# EasyEDA Pro project PCBA_碳化硅3KW图腾柱PFC_2025-04-21.epro, board PCB1_1
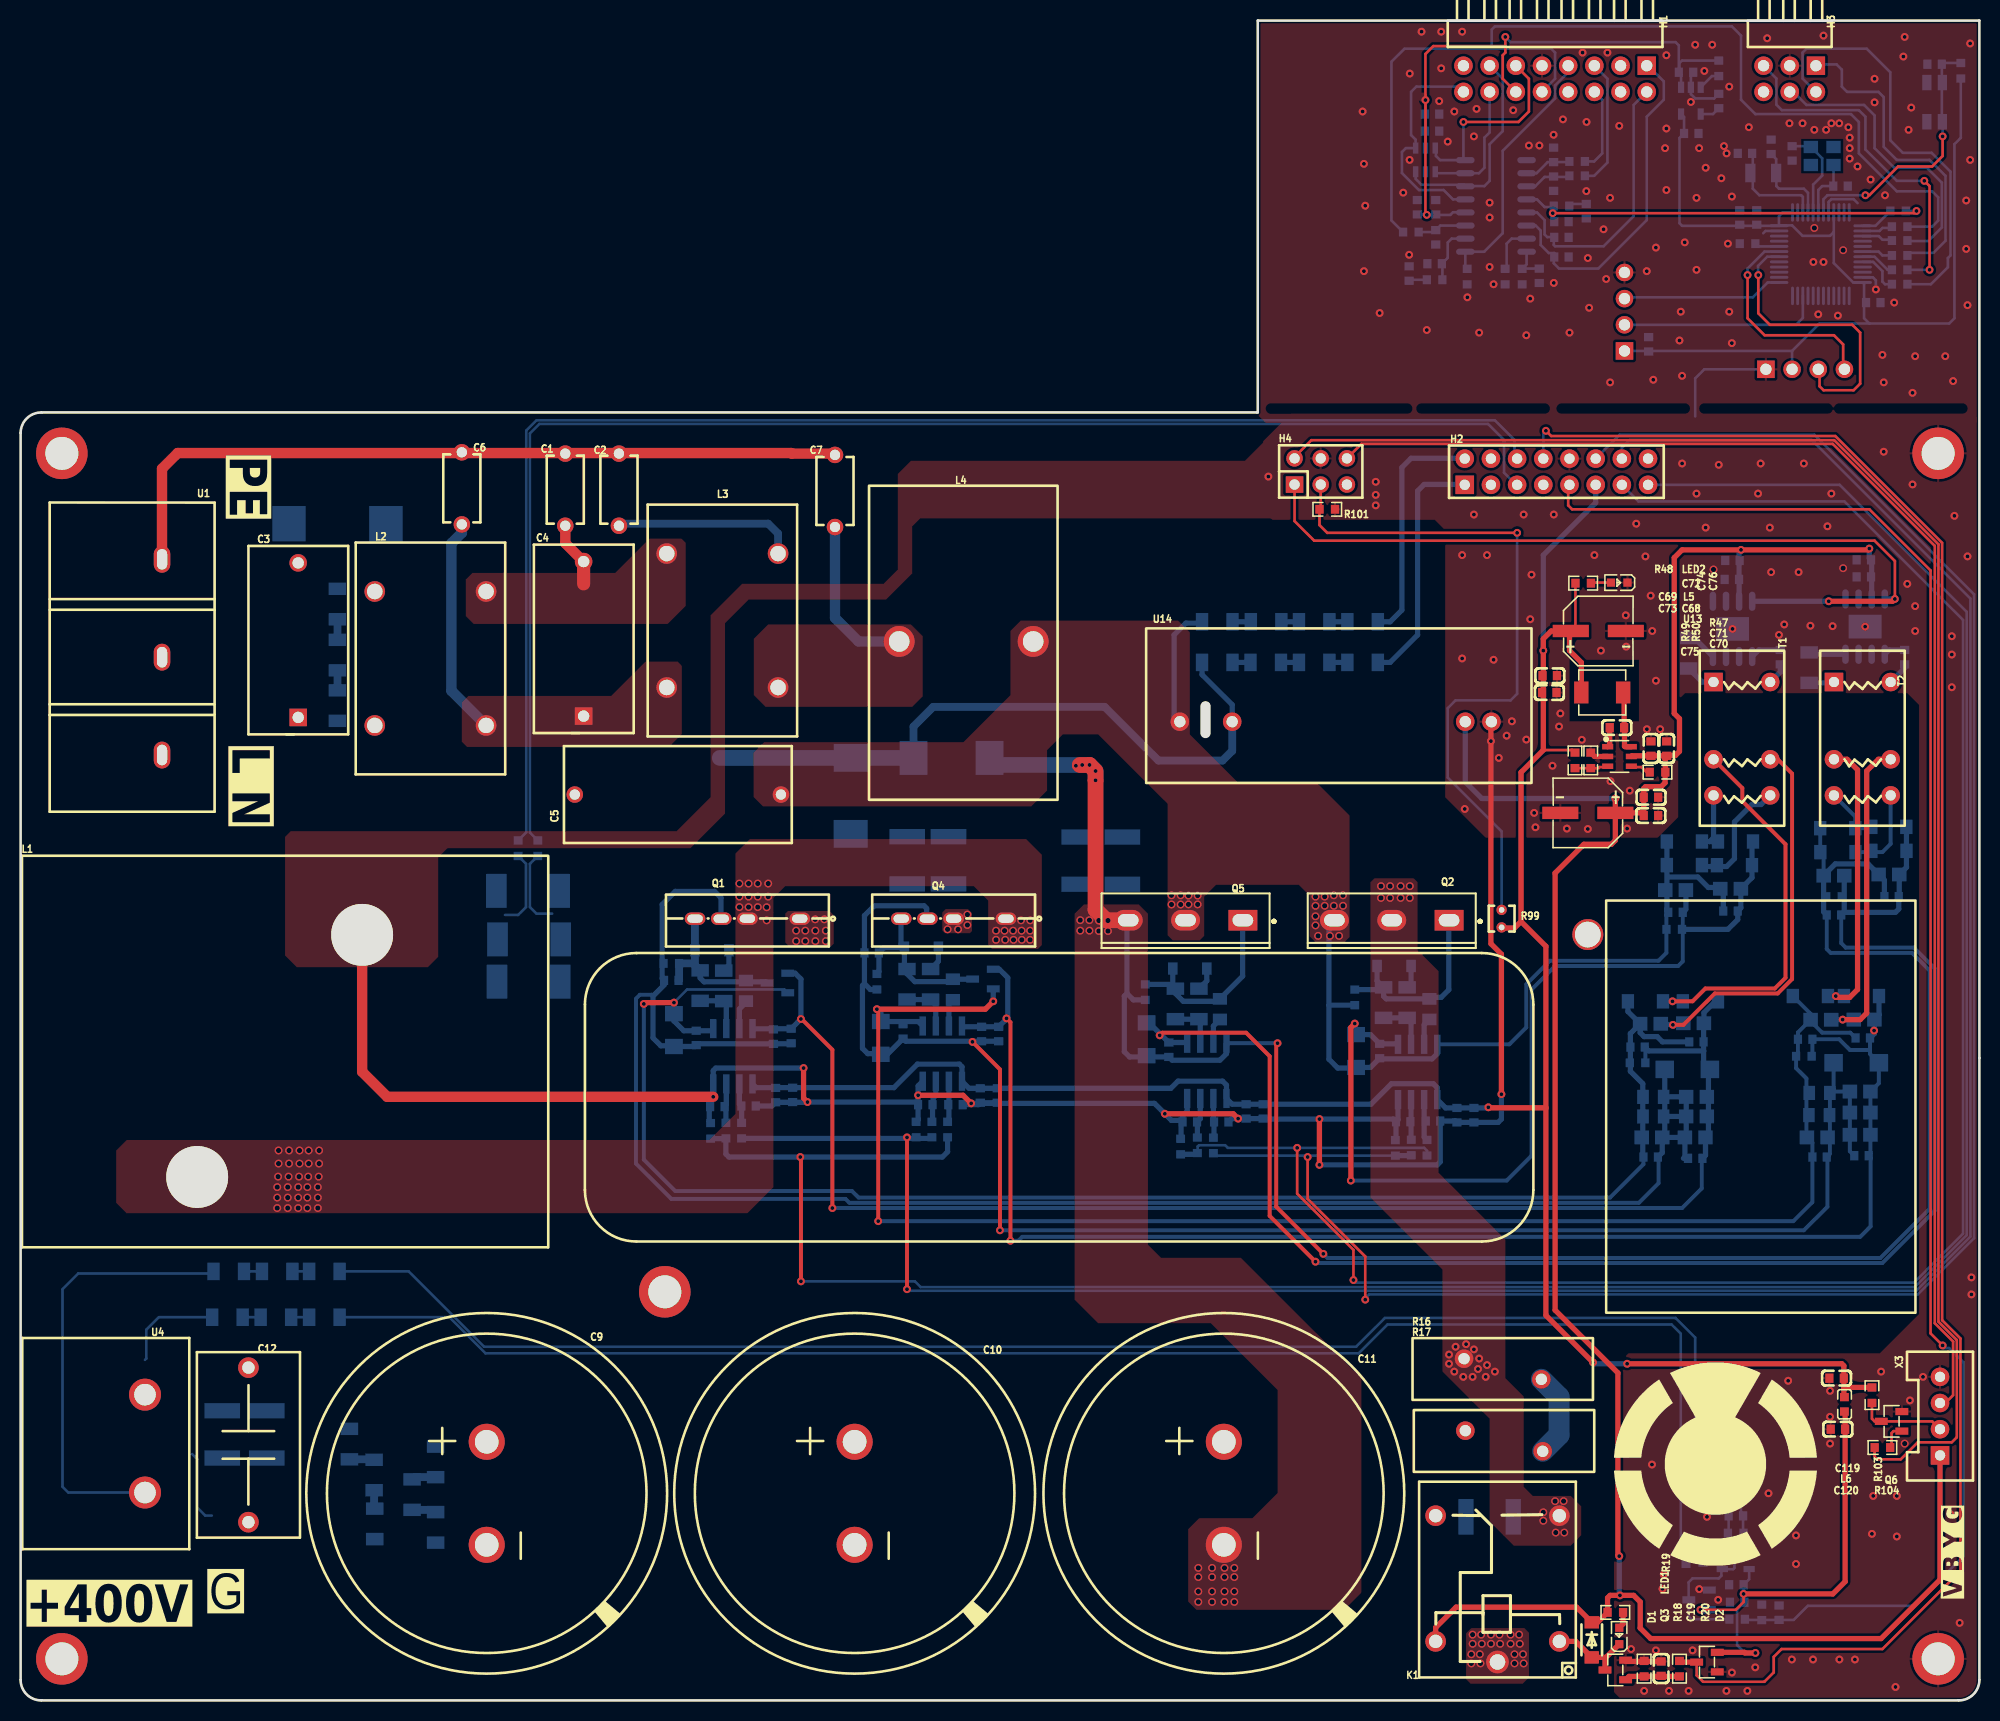
[diagram p6: board, top side]
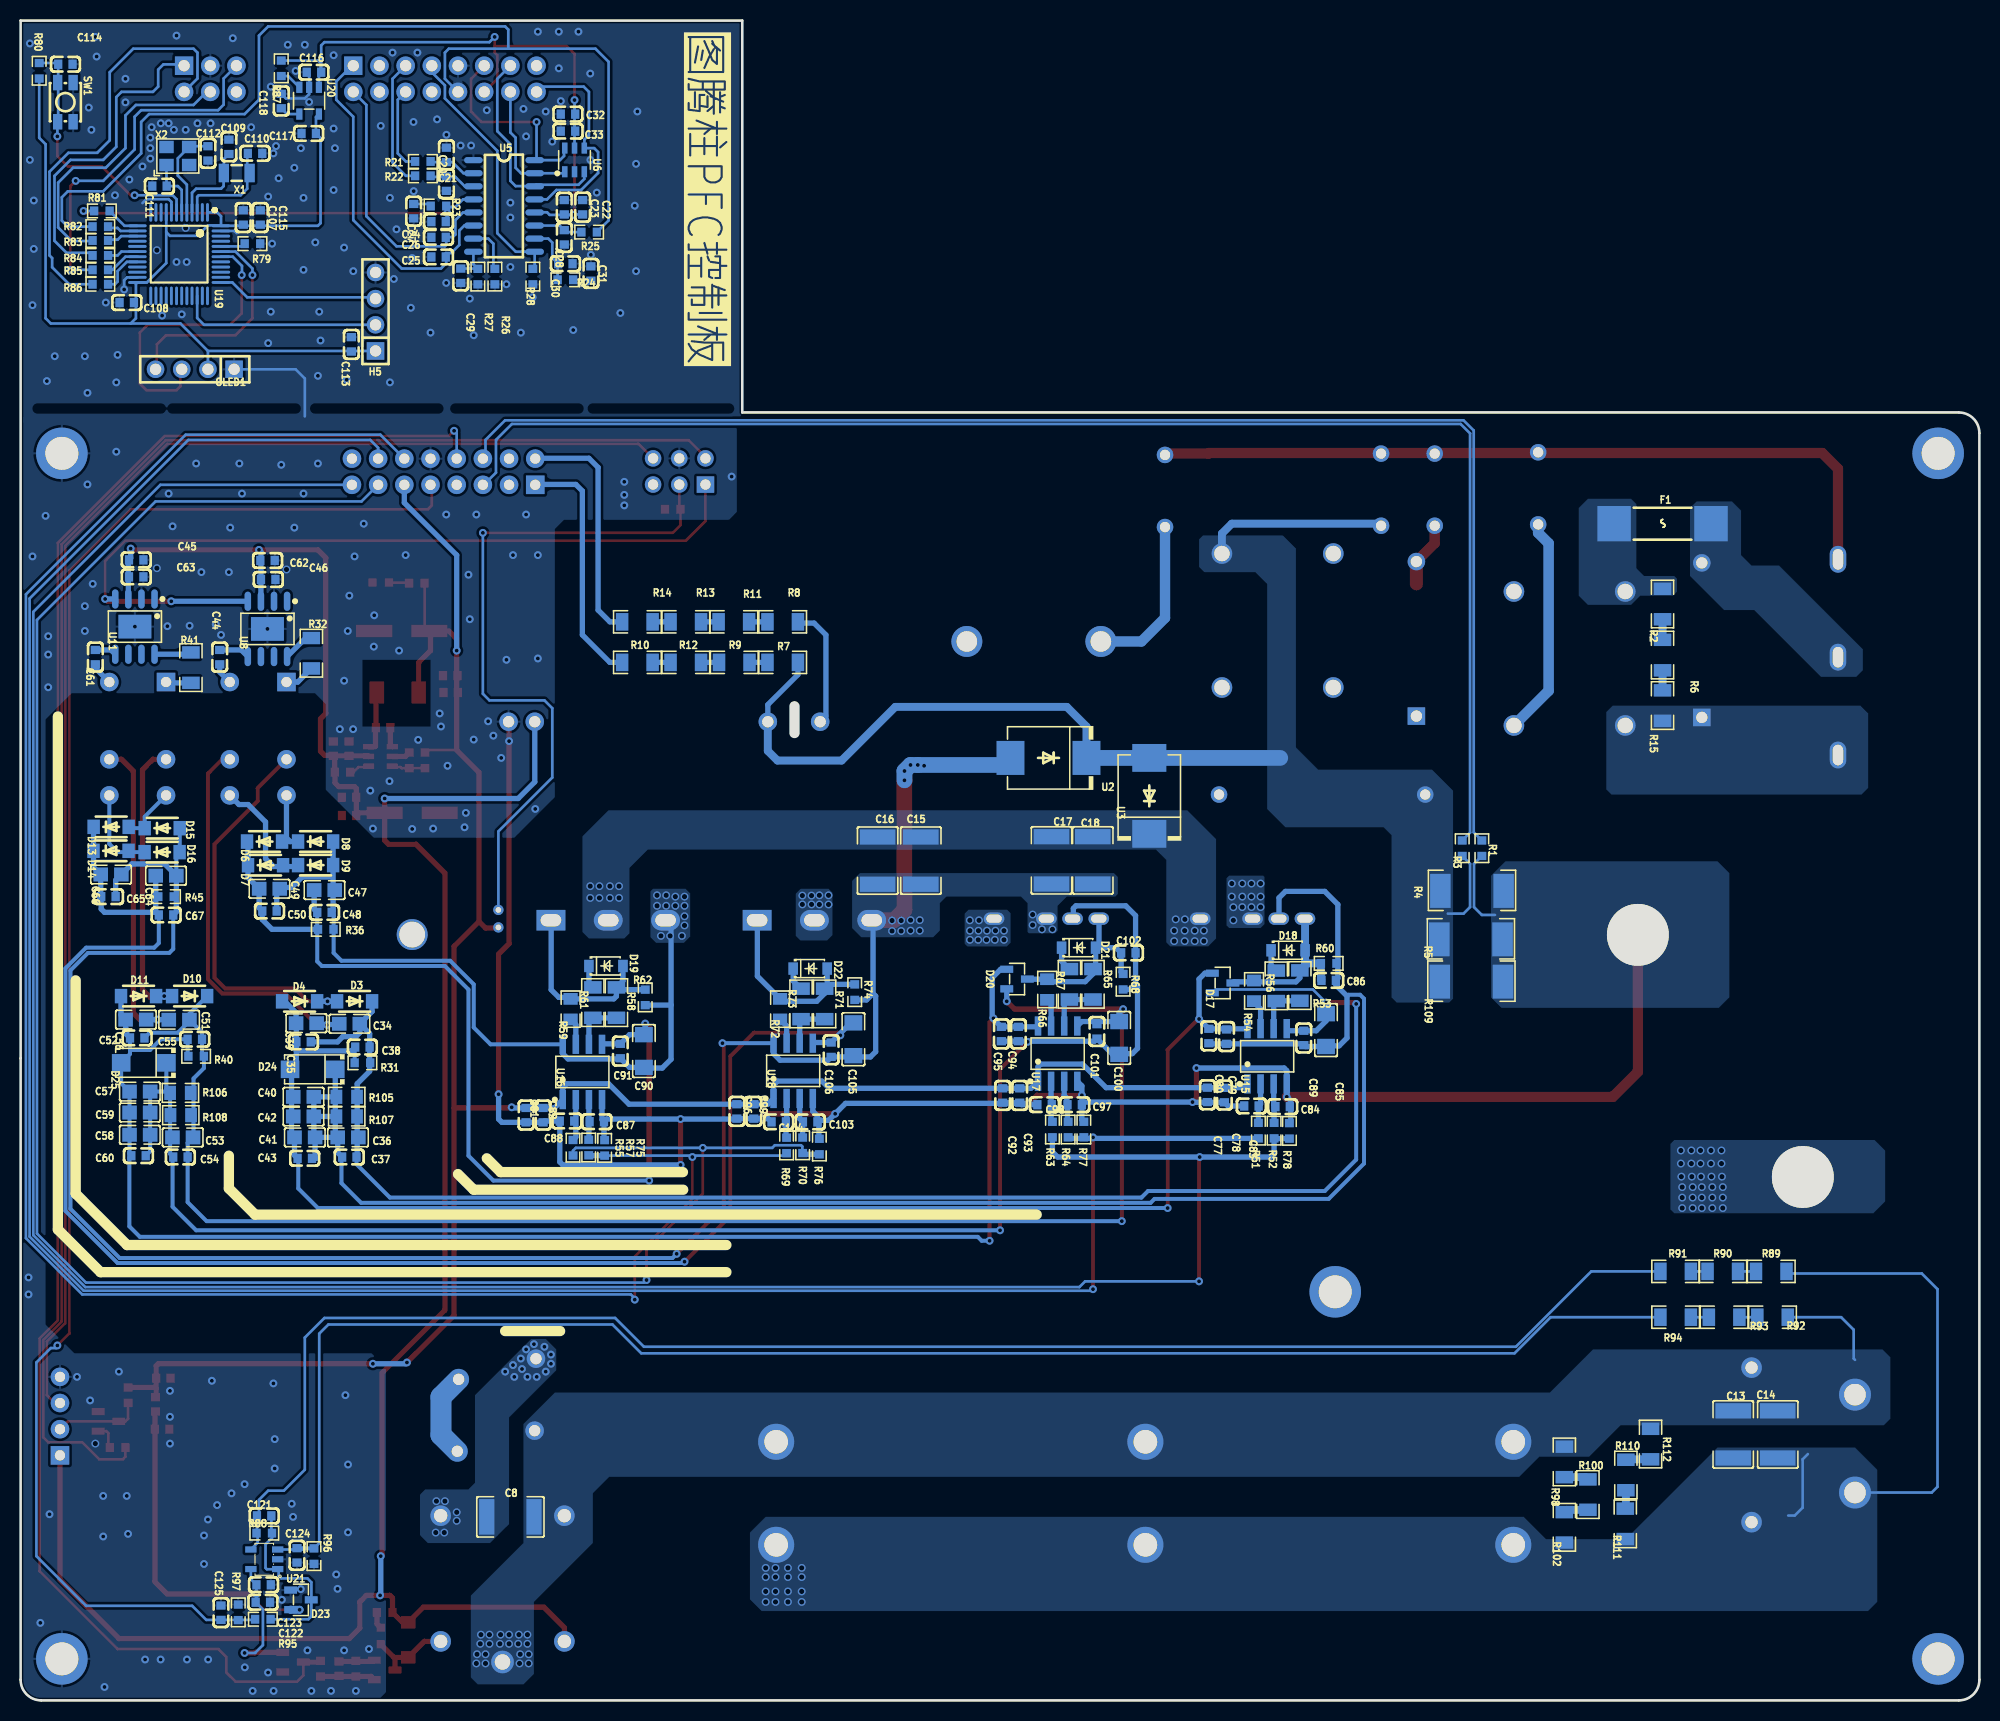
[diagram p7: board, bottom side, seen from below]

Outline 190 x 163.03 mm; copper layers: Top Layer, Bottom Layer. Coordinates in mm from the lower left corner of the outline.
Outline path: 0,123 0,2 arc(0.59,0.59) 2,0 188,0 arc(189.41,0.59) 190,2 190,163.03 120,163.03 120,125 2,125 arc(0.59,124.41) 0,123
Stack: Top Layer 0.035mm / Dielectric1 1.51mm FR4 er 4.5 / Bottom Layer 0.035mm

## Design rules (mm)
template: JLCPCB Capability(Two Layers Board)
spacing copperThickness1oz (default): track to track 0.102, other pairs 0.152 to 0.3
spacing copperThickness2oz: track to track 0.203, other pairs 0.152 to 0.3
track width copperThickness1oz (default): min 0.127, default 0.254, max 2.54
track width copperThickness2oz: min 0.203, default 0.254, max 2.54
differential pair differentialPair (default): width min 0.127, default 0.254, max 2.54; gap min 0.152, default 0.152
via viaSize (default): diameter min 0.5, default 0.61, max 10; hole min 0.3, default 0.305, max 6.3

## Placement (name value [footprint] x y rotation side)
C1  2.2nF  [CAP-TH_L6.5-W3.5-P7.50-D1.0]  52.83 117.51 90 top
C2  2.2nF  [CAP-TH_L6.5-W3.5-P7.50-D1.0]  58.04 117.51 90 top
C3  1uF  [CONN-TH_L18.0-W9.5_MPX105K31D5KN15800]  26.92 102.9 90 top
C4  1uF  [CONN-TH_L18.0-W9.5_MPX105K31D5KN15800]  54.61 103.03 90 top
C5  2.2uF  [CAP-TH_L22.0-W9.5-P20.00-D0.7]  63.75 87.92 180 top
C6  2.2nF  [CAP-TH_L6.5-W3.5-P7.50-D1.0]  42.8 117.63 270 top
C7  2.2nF  [CAP-TH_L6.5-W3.5-P7.50-D1.0]  78.99 117.38 90 top
C8  100nF  [C1812]  142.49 17.81 0 bottom
C9  470uF  [CAP-TH_BD35.0-P10.00-D2.3-FD]  45.21 20.1 270 top
C10  470uF  [CAP-TH_BD35.0-P10.00-D2.3-FD]  80.9 20.1 270 top
C11  470uF  [CAP-TH_BD35.0-P10.00-D2.3-FD]  116.71 20.1 270 top
C12  100nF  [CAP-TH_L18.0-W10.0-P15.00-D0.8]  22.1 24.8 90 top
C13  100nF  [C1812]  23.88 25.81 90 bottom
C14  100nF  [C1812]  19.56 25.81 90 bottom
C15  100nF  [C1812]  102.68 81.5 270 bottom
C16  100nF  [C1812]  106.87 81.5 270 bottom
C17  100nF  [C1812]  90 81.53 90 bottom
C18  100nF  [C1812]  86 81.53 90 bottom
C19  1nF  [C0603]  159.13 3.08 270 top
C20  1nF  [C0603]  148.7 150 90 bottom
C21  1nF  [C0603]  148.7 147.2 270 bottom
C22  1uF  [C0603]  135.49 144.92 270 bottom
C23  100nF  [C0603]  137.27 144.92 90 bottom
C24  22pF  [C0603]  149.46 143.52 180 bottom
C25  22pF  [C0603]  149.46 140.09 180 bottom
C26  22pF  [C0603]  149.46 142 180 bottom
C27  4.7nF  [C0603]  151.87 144.54 90 bottom
C28  1nF  [C0603]  137.27 142 90 bottom
C29  3.3uF  [C0603]  147.31 138.27 90 bottom
C30  22nF  [C0603]  137.16 139.44 0 bottom
C31  470nF  [C0603]  134.69 138.49 270 bottom
C32  1uF  [C0603]  136.91 153.96 180 bottom
C33  100nF  [C0603]  136.91 152.31 0 bottom
C34  4.7uF  [C0805]  158.1 65.67 180 bottom
C35  100nF  [C0603]  162.55 63.91 180 bottom
C36  10uF  [C0805]  158.24 54.64 180 bottom
C37  100nF  [C0603]  158.12 52.74 180 bottom
C38  10nF  [C0603]  156.84 63.41 180 bottom
C39  4.7uF  [C0805]  162.28 65.72 180 bottom
C40  10uF  [C0805]  162.56 58.58 180 bottom
C41  10uF  [C0805]  162.43 54.64 180 bottom
C42  10uF  [C0805]  162.56 56.67 180 bottom
C43  100nF  [C0603]  162.44 52.61 180 bottom
C44  1uF  [C0603]  170.69 101.25 270 bottom
C45  1uF  [C0603]  178.79 110.69 0 bottom
C46  100nF  [C0603]  165.99 108.79 0 bottom
C47  4.7uF  [C0805]  160.53 78.65 0 bottom
C48  100nF  [C0603]  160.53 76.49 0 bottom
C49  10uF  [C0805]  165.86 78.77 0 bottom
C50  10nF  [C0603]  165.86 76.61 0 bottom
C51  4.7uF  [C0805]  174.63 66.06 180 bottom
C52  100nF  [C0603]  178.69 64.29 180 bottom
C53  10uF  [C0805]  174.28 54.64 180 bottom
C54  100nF  [C0603]  174.5 52.74 180 bottom
C55  10nF  [C0603]  173.1 64.17 180 bottom
C56  4.7uF  [C0805]  178.82 66.07 180 bottom
C57  10uF  [C0805]  178.44 59.09 180 bottom
C58  10uF  [C0805]  178.44 54.9 180 bottom
C59  10uF  [C0805]  178.44 57.06 180 bottom
C60  100nF  [C0603]  178.56 52.86 180 bottom
C61  1uF  [C0603]  182.75 101.25 270 bottom
C62  1uF  [C0603]  166.05 110.64 0 bottom
C63  100nF  [C0603]  178.79 109.04 0 bottom
C64  4.7uF  [C0805]  175.9 80.04 0 bottom
C65  100nF  [C0603]  181.48 78.01 0 bottom
C66  10uF  [C0805]  181.23 80.16 0 bottom
C67  10nF  [C0603]  175.9 76.23 0 bottom
C68  100nF  [C0603]  154.84 94.41 0 top
C69  100nF  [C0603]  148.33 99.46 180 top
C70  1uF  [C0603]  158.14 85.88 0 top
C71  100nF  [C0603]  158.14 87.66 180 top
C72  100uF  [CAP-SMD_BD6.3-L6.6-W6.6-FD]  153.03 103.79 0 top
C73  1uF  [C0603]  148.28 97.82 180 top
C74  100nF  [C0603]  158.14 92.38 270 top
C75  47uF  [CAP-SMD_BD6.3-L6.6-W6.6-LS7.2-FD]  152.02 86.14 180 top
C76  1uF  [C0603]  159.67 92.38 270 top
C77  1uF  [C0603]  74.89 58.77 270 bottom
C78  100nF  [C0603]  73.23 58.75 270 bottom
C79  100nF  [C0603]  73.03 64.42 270 bottom
C80  10uF  [C0603]  74.74 64.48 270 bottom
C81  1uF  [C0603]  140.97 56.8 270 bottom
C82  100nF  [C0603]  139.32 56.8 270 bottom
C83  220pF  [C0603]  70.61 57.69 180 bottom
C84  220pF  [C0603]  67.59 57.63 0 bottom
C85  10uF  [C1206]  63.37 65.06 90 bottom
C86  1nF  [C0603]  63.12 69.88 0 bottom
C87  220pF  [C0603]  134.11 56.17 0 bottom
C88  220pF  [C0603]  137 56.23 180 bottom
C89  100nF  [C0603]  65.53 64.29 90 bottom
C90  10uF  [C1206]  129.54 63.02 90 bottom
C91  100nF  [C0603]  131.83 63.02 90 bottom
C92  1uF  [C0603]  94.74 58.71 270 bottom
C93  100nF  [C0603]  93.09 58.71 270 bottom
C94  100nF  [C0603]  93.22 64.68 270 bottom
C95  10uF  [C0603]  94.87 64.68 270 bottom
C96  1uF  [C0603]  120.53 57.16 270 bottom
C97  220pF  [C0603]  87.76 57.82 0 bottom
C98  220pF  [C0603]  90.68 57.82 180 bottom
C99  100nF  [C0603]  118.87 57.16 270 bottom
C100  10uF  [C1206]  83.44 64.29 90 bottom
C101  100nF  [C0603]  85.6 64.93 90 bottom
C102  1nF  [C0603]  82.55 72.55 0 bottom
C103  220pF  [C0603]  113.41 56.15 0 bottom
C104  220pF  [C0603]  116.46 56.15 180 bottom
C105  10uF  [C1206]  109.22 64.17 90 bottom
C106  100nF  [C0603]  111.38 63.15 90 bottom
C107  100nF  [C0603]  166.75 143.92 90 bottom
C108  100nF  [C0603]  179.71 135.67 0 bottom
C109  10pF  [C0603]  169.8 150.78 270 bottom
C110  10pF  [C0603]  167.26 150.15 180 bottom
C111  10pF  [C0603]  176.53 146.97 180 bottom
C112  10pF  [C0603]  171.83 150.15 270 bottom
C113  100nF  [C0603]  157.92 131.61 90 bottom
C114  100nF  [C0603]  185.66 158.8 0 bottom
C115  100nF  [C0603]  168.4 143.92 90 bottom
C116  1uF  [C0603]  161.54 158.02 180 bottom
C117  1uF  [C0603]  162.05 152.08 180 bottom
C118  22nF  [C0603]  164.72 155.23 270 bottom
C119  10uF  [C0603]  176.15 31.27 0 top
C120  10uF  [C0603]  176.28 26.32 0 top
C121  1nF  [C0603]  166.38 17.91 0 bottom
C122  1uF  [C0603]  166.5 9.53 0 bottom
C123  100nF  [C0603]  166.43 11.22 180 bottom
C124  1nF  [C0603]  163.19 14.08 270 bottom
C125  1nF  [C0603]  170.57 8.51 270 bottom
D1  DSK110  [SOD-123_L2.8-W1.8-LS3.7-FD]  152.4 5.87 90 top
D2  BAV99  [SOT-23-3_L2.9-W1.3-P1.90-LS2.4-BR]  163.58 3.72 0 top
D3  DSK110  [SOD-123_L2.8-W1.8-LS3.7-FD]  157.61 67.85 180 bottom
D4  null  [SOD-123_L2.8-W1.8-LS3.7-FD]  162.94 67.85 180 bottom
D6  DSK110  [SOD-123_L2.8-W1.8-LS3.7-FD]  166.34 83.36 0 bottom
D7  DSK110  [SOD-123_L2.8-W1.8-LS3.7-FD]  166.24 81.06 0 bottom
D8  null  [SOD-123_L2.8-W1.8-LS3.7-FD]  161.39 83.36 0 bottom
D9  DSK110  [SOD-123_L2.8-W1.8-LS3.7-FD]  161.39 81.07 0 bottom
D10  DSK110  [SOD-123_L2.8-W1.8-LS3.7-FD]  173.61 68.36 180 bottom
D11  null  [SOD-123_L2.8-W1.8-LS3.7-FD]  178.56 68.36 180 bottom
D13  DSK110  [SOD-123_L2.8-W1.8-LS3.7-FD]  181.22 84.78 0 bottom
D14  DSK110  [SOD-123_L2.8-W1.8-LS3.7-FD]  181.23 82.46 0 bottom
D15  null  [SOD-123_L2.8-W1.8-LS3.7-FD]  176.26 84.65 0 bottom
D16  DSK110  [SOD-123_L2.8-W1.8-LS3.7-FD]  176.28 82.33 0 bottom
D17  BAV99  [SOT-23-3_L2.9-W1.3-P1.90-LS2.4-BR]  73.41 69.63 0 bottom
D18  SODSF14-SH  [SOD-123FL_L2.8-W1.8-LS3.7-RD-1]  67.06 72.8 180 bottom
D19  SODSF14-SH  [SOD-123FL_L2.8-W1.8-LS3.7-RD-1]  133.22 71.28 180 bottom
D20  BAV99  [SOT-23-3_L2.9-W1.3-P1.90-LS2.4-BR]  93.34 70.01 0 bottom
D21  SODSF14-SH  [SOD-123FL_L2.8-W1.8-LS3.7-RD-1]  87.38 73.06 180 bottom
D22  SODSF14-SH  [SOD-123FL_L2.8-W1.8-LS3.7-RD-1]  113.41 71.03 180 bottom
D23  BAV99  [SOT-23-3_L2.9-W1.3-P1.90-LS2.4-BR]  162.81 9.76 0 bottom
D24  null  [SMA_L4.4-W2.6-LS5.0-RD]  161.67 61.25 0 bottom
D25  null  [SMA_L4.4-W2.6-LS5.0-RD]  178.05 61.88 0 bottom
F1  0463020.ER  [FUSE-SMD_L10.1-W3.1]  30.73 114.21 0 bottom
H1  PZ254R-12-16P  [HDR-TH_16P-P2.54-H-M-R2-C8-S2.54]  148.84 157.39 180 top
H2  2.54-2*8P母  [HDR-TH_16P-P2.54-V-F-R2-C8-S2.54]  148.97 119.25 0 top
H3  PZ254R-12-6P  [HDR-TH_6P-P2.54-H-M-R2-C3-S2.54]  171.6 157.39 180 top
H4  DS1023-2*3SF11  [HDR-TH_6P-P2.54-V-F-R2-C3-S2.54]  126.11 119.27 0 top
H5  -  [HDR-TH_4P-P2.54-V-M]  155.57 134.78 90 bottom
K1  JQC-3FF/12VDC-1ZS（551)  [RELAY-TH_HF3FF-XX-1ZXX-XXX]  143.26 10.83 90 top
L1  -  [PQ50电感]  0.13 43.97 0 top
L2  FC-HLF2018-5mH-25A-LF  [IND-TH_4P-L22.5-W14.5-P13.00-D1.2-LS10.80]  39.75 101.12 90 top
L3  FC-HLF2018-5mH-25A-LF  [IND-TH_4P-L22.5-W14.5-P13.00-D1.2-LS10.80]  68.07 104.81 90 top
L4  差模电感  [22uH/20A]  82.42 87.28 0 top
L5  10uH  [IND-SMD_L4.4-W4.2]  153.42 97.82 0 top
L6  PBY160808T-601Y-N  [L0603]  176.91 28.73 270 top
LED1  KT-0603R  [LED0603-RD]  155.07 6.26 90 top
LED2  KT-0603R  [LED0603-RD]  155.07 108.49 180 top
NOREF  -  [Pad_e72]  62.48 39.66 0 top
NOREF#2  -  [Pad_e85]  4 4.03 0 top
NOREF#3  -  [Pad_e96]  152.02 74.33 0 top
NOREF#4  -  [Pad_e86]  4 121.03 0 top
NOREF#5  -  [Pad_e87]  186 121.03 0 top
NOREF#6  -  [Pad_e88]  186 4.03 0 top
OLED1  2.54-1*4P母  [HDR-TH_4P-P2.54-V-F]  173.1 129.19 0 bottom
Q1  C3M0021120K  [TO-247-4_L15.8-W5.0-P2.54-L]  70.5 75.87 180 top
Q2  IPW60R060P7  [TO-247-3_L15.9-W5.1-P5.44-L]  133 75.72 180 top
Q3  2N7002  [SOT-23-3_L2.9-W1.3-P1.90-LS2.4-BR]  154.69 2.95 0 top
Q4  C3M0021120K  [TO-247-4_L15.8-W5.0-P2.54-L]  90.5 75.87 180 top
Q5  IPW60R060P7  [TO-247-3_L15.9-W5.1-P5.44-L]  113 75.72 180 top
Q6  2N7002  [SOT-23-3_L2.9-W1.3-P1.90-LS2.4-BR]  181.48 27.08 0 top
R1  0Ω  [R0603]  48.26 82.71 270 bottom
R2  100kΩ  [R1206]  30.73 106.41 90 bottom
R3  0Ω  [R0603]  50.17 82.71 90 bottom
R4  25mΩ  [RES-SMD_L6.4-W3.2-R2512]  49.22 78.57 180 bottom
R5  25mΩ  [RES-SMD_L6.4-W3.2-R2512]  49.32 73.86 180 bottom
R6  100kΩ  [R1206]  30.73 101.45 90 bottom
R7  330kΩ  [R1206]  116.08 100.74 0 bottom
R8  330kΩ  [R1206]  116.08 104.68 0 bottom
R9  330kΩ  [R1206]  120.78 100.74 0 bottom
R10  100kΩ  [R1206]  130.18 100.74 0 bottom
R11  330kΩ  [R1206]  120.81 104.68 0 bottom
R12  340kΩ  [R1206]  125.48 100.74 0 bottom
R13  340kΩ  [R1206]  125.48 104.68 0 bottom
R14  100kΩ  [R1206]  130.18 104.68 0 bottom
R15  100kΩ  [R1206]  30.73 96.55 90 bottom
R16  MF72 10D15  [RES-TH_L17.5-W6.0-P7.50-D1.0-S2.00]  143.76 32.16 0 top
R17  MF72 10D15  [RES-TH_L17.5-W6.0-P7.50-D1.0-S2.00]  143.89 25.18 180 top
R18  10kΩ  [R0603]  157.48 3.08 270 top
R19  10kΩ  [R0603]  154.69 8.54 180 top
R20  1kΩ  [R0603]  160.91 3.08 270 top
R21  1kΩ  [R0603]  150.98 149.36 0 bottom
R22  1kΩ  [R0603]  150.98 147.97 0 bottom
R23  60.4kΩ  [R0603]  149.47 145.04 180 bottom
R24  60.4kΩ  [R0603]  137.16 137.88 0 bottom
R25  4.99kΩ  [R0603]  134.85 142.51 180 bottom
R26  30.9kΩ  [R0603]  144 138.19 90 bottom
R27  51kΩ  [R0603]  145.65 138.19 90 bottom
R28  39kΩ  [R0603]  140.31 138.19 90 bottom
R31  10kΩ  [R0603]  156.84 61.88 180 bottom
R32  1Ω  [R1206]  161.8 101.63 270 bottom
R36  10kΩ  [R0603]  160.4 74.84 0 bottom
R40  10kΩ  [R0603]  172.97 62.52 180 bottom
R41  1Ω  [R1206]  173.48 100.24 270 bottom
R45  10kΩ  [R0603]  175.9 78.01 0 bottom
R47  10kΩ  [R0603]  158.78 90.09 0 top
R48  4.7kΩ  [R0603]  151.57 108.43 0 top
R49  24kΩ  [R0603]  150.78 91.23 90 top
R50  3.3kΩ  [R0603]  152.3 91.23 270 top
R51  100Ω  [R0603]  69.94 55.3 90 bottom
R52  100Ω  [R0603]  68.41 55.3 90 bottom
R53  10Ω  [R1206]  65.91 69.37 90 bottom
R54  0Ω  [R0805]  70.36 68.87 90 bottom
R55  100Ω  [R0603]  136.42 53.64 90 bottom
R56  10Ω  [R1206]  68.2 69.35 90 bottom
R57  100Ω  [R0603]  134.89 53.66 90 bottom
R58  10Ω  [R1206]  132.21 67.72 90 bottom
R59  0Ω  [R0805]  136.65 67.09 90 bottom
R60  10kΩ  [R0603]  63.12 71.53 0 bottom
R61  10Ω  [R1206]  134.49 67.72 90 bottom
R62  10kΩ  [R0603]  129.41 68.23 90 bottom
R63  100Ω  [R0603]  89.92 55.4 90 bottom
R64  100Ω  [R0603]  88.39 55.4 90 bottom
R65  10Ω  [R1206]  85.98 69.5 90 bottom
R66  0Ω  [R0805]  90.42 68.99 90 bottom
R67  10Ω  [R1206]  88.26 69.5 90 bottom
R68  10kΩ  [R0603]  83.06 69.76 90 bottom
R69  100Ω  [R0603]  115.7 53.86 90 bottom
R70  100Ω  [R0603]  114.14 53.87 90 bottom
R71  10Ω  [R1206]  112.01 67.6 90 bottom
R72  0Ω  [R0805]  116.33 67.09 90 bottom
R73  10Ω  [R1206]  114.3 67.6 90 bottom
R74  10kΩ  [R0603]  109.09 68.74 90 bottom
R75  10kΩ  [R0603]  133.35 53.63 270 bottom
R76  10kΩ  [R0603]  112.52 53.75 270 bottom
R77  10kΩ  [R0603]  86.87 55.4 270 bottom
R78  10kΩ  [R0603]  66.93 55.28 270 bottom
R79  10kΩ  [R0603]  167.51 141.38 180 bottom
R80  10kΩ  [R0603]  188.2 158.17 270 bottom
R81  10kΩ  [R0603]  182.12 144.56 180 bottom
R82  0Ω  [R0603]  182.27 143.03 180 bottom
R83  0Ω  [R0603]  182.27 141.69 180 bottom
R84  0Ω  [R0603]  182.27 140.24 180 bottom
R85  0Ω  [R0603]  182.27 138.84 180 bottom
R86  0Ω  [R0603]  182.27 137.45 180 bottom
R87  100kΩ  [R0603]  164.72 158.4 90 bottom
R88  4.99kΩ  [R0603]  166.37 16.24 180 bottom
R89  330kΩ  [R1206]  20.19 41.64 0 bottom
R90  330kΩ  [R1206]  24.89 41.64 0 bottom
R91  340kΩ  [R1206]  29.46 41.64 0 bottom
R92  330kΩ  [R1206]  20.06 37.19 0 bottom
R93  330kΩ  [R1206]  24.76 37.19 0 bottom
R94  340kΩ  [R1206]  29.46 37.19 0 bottom
R95  100Ω  [R0603]  166.5 7.88 0 bottom
R96  4.99kΩ  [R0603]  161.54 14 90 bottom
R97  5.1kΩ  [R0603]  168.89 8.55 90 bottom
R98  100kΩ  [R1206]  40.26 23.15 90 bottom
R99  MF52A103F3950 (A1)  [RES-TH_L2.5-W2.5-P1.70-D0.3]  143.66 75.87 270 top
R100  100kΩ  [R1206]  37.97 19.97 90 bottom
R101  1kΩ  [R0603]  126.75 115.6 180 top
R102  100kΩ  [R1206]  40.26 16.8 90 bottom
R103  10kΩ  [R0603]  179.58 29.62 90 top
R104  1kΩ  [R0603]  180.59 24.54 180 top
R105  4.7K  [R0805]  158.37 58.58 180 bottom
R106  4.7K  [R0805]  174.5 58.96 180 bottom
R107  4.7K  [R0805]  158.37 56.67 180 bottom
R108  4.7K  [R0805]  174.47 56.8 180 bottom
R109  25mΩ  [RES-SMD_L6.4-W3.2-R2512]  49.28 69.76 180 bottom
R110  100kΩ  [R1206]  34.29 21.88 90 bottom
R111  100kΩ  [R1206]  34.35 17.13 90 bottom
R112  100kΩ  [R1206]  31.9 24.88 90 bottom
SW1  TS-1185EC-C-D-B  [SW-SMD_4P-L3.7-W3.0-P1.50-LS4.7]  185.66 155.12 270 bottom
T1  -  [TR1495_10_20_20]  164.21 98.84 270 top
T2  -  [TR1495_10_20_20]  175.9 98.84 270 top
U1  DBT50G-9.5-3P-BK-P OGC  [CONN-TH_3P-P9.50_DBT50G-9.5-3P]  13.72 101.25 270 top
U2  S10J  [SMC_L6.9-W5.9-LS7.9-RD]  90.3 91.47 0 bottom
U3  S10J  [SMC_L6.9-W5.9-LS7.9-RD]  80.52 87.79 90 bottom
U4  DBT50G-9.5-2P-BK-P OGC  [CONN-TH_2P-P9.50_DBT50G-9.5-2P]  12.06 24.92 270 top
U5  IVCC1102DR  [SOIC-16_L9.9-W3.9-P1.27-LS6.0-BL-1]  143.11 145.05 270 bottom
U6  USBLC6-4SC6  [SOT-23-6_L2.9-W1.6-P0.95-LS2.8-BL]  136.27 149.51 180 bottom
U8  null  [ESOP-8_L4.9-W3.9-P1.27-LS6.0-BL-EP-4]  166.06 103.99 0 bottom
U11  null  [ESOP-8_L4.9-W3.9-P1.27-LS6.0-BL-EP-4]  178.92 104.22 0 bottom
U13  null  [SOT-23-6_L2.9-W1.6-P0.95-LS2.8-BL]  155.09 91.61 270 top
U14  -  [DC-AUX-12V]  146.56 104.05 180 top
U15  IVCO1A02DR  [SOIC-8_L4.9-W4.0-P1.27-LS6.0-BL]  69.09 62.52 180 bottom
U16  IVCO1A02DR  [SOIC-8_L4.9-W4.0-P1.27-LS6.0-BL]  135.51 60.99 180 bottom
U17  IVCO1A02DR  [SOIC-8_L4.9-W4.0-P1.27-LS6.0-BL]  89.41 62.77 180 bottom
U18  IVCO1A02DR  [SOIC-8_L4.9-W4.0-P1.27-LS6.0-BL]  115.06 61.1 180 bottom
U19  CW32F030C8T6  [LQFP-48_L7.0-W7.0-P0.50-LS9.0-TL]  174.62 140.37 270 bottom
U20  RT9193-33  [SOT-23-5_L2.9-W1.6-P0.95-LS2.8-TL]  162.01 155.26 270 bottom
U21  OPA376AIDBVR  [SOT-23-5_L3.0-W1.7-P0.95-LS2.8-BR]  166.37 13.7 180 bottom
X1  32.768kHz  [FC-135R_L3.2-W1.5]  169.04 148.24 180 bottom
X2  8MHz  [OSC-SMD_4P-L3.2-W2.5-BL]  174.75 149.89 180 bottom
X3  B04B-XASK-1(LF)(SN)  [CONN-TH_B04B-XASK-1-LF-SN]  186.18 27.59 270 top

## Footprints (pads in the part's own frame, mm; a bottom-side part is the same pattern mirrored in y, then rotated)
22uH/20A
  round 3 hole 2: 1(2.794,15.494) 2(15.794,15.494)
C0603
  rect 0.8x0.9 smd: 1(-0.7,0) 2(0.7,0)
C0805
  rect 1.41x1.35 smd: 1(-1,0) 2(1,0)
C1206
  rect 1.485x1.728 smd: 1(-1.593,0) 2(1.593,0)
C1812
  rect 1.485x3.456 smd: 1(-2.292,0) 2(2.292,0)
CAP-SMD_BD6.3-L6.6-W6.6-FD
  rect 3.5x1.2 smd: 1(-2.67,0) 2(2.67,0)
CAP-SMD_BD6.3-L6.6-W6.6-LS7.2-FD
  rect 3.5x1.2 smd: 1(-2.67,0) 2(2.67,0)
CAP-TH_BD35.0-P10.00-D2.3-FD
  round 3.5 hole 2.3: 1(-5,0) 2(5,0)
CAP-TH_L6.5-W3.5-P7.50-D1.0
  round 1.6 hole 1: 1(-3.5,0) 2(3.5,0)
CAP-TH_L18.0-W10.0-P15.00-D0.8
  round 2 hole 1.2: 1(-7.5,0) 2(7.5,0)
CAP-TH_L22.0-W9.5-P20.00-D0.7
  round 1.6 hole 1: 1(-10,0) 2(10,0)
CONN-TH_2P-P9.50_DBT50G-9.5-2P
  round 3.1 hole 2.1: 1(-4.75,0) 2(4.75,0)
CONN-TH_3P-P9.50_DBT50G-9.5-3P
  oval 2.6x1.6 hole 2x1: 1(-9.5,0) 2(0,0) 3(9.5,0)
CONN-TH_B04B-XASK-1-LF-SN
  rect 1.8x1.8 hole 1: 1(3.81,0)
  round 1.8 hole 1: 2(1.27,0) 3(-1.27,0) 4(-3.81,0)
CONN-TH_L18.0-W9.5_MPX105K31D5KN15800
  rect 1.7x1.7 hole 1.1: 1(-7.5,0)
  round 1.7 hole 1.1: 2(7.5,0)
DC-AUX-12V
  round 1.8 hole 1.1: 1(34.115,9.059) 2(29.035,9.059) 3(6.429,9.059) 4(3.889,9.059)
ESOP-8_L4.9-W3.9-P1.27-LS6.0-BL-EP-4
  oval 0.63x1.865 smd: 1(-1.905,-2.683) 2(-0.635,-2.683) 3(0.635,-2.683) 4(1.905,-2.683) 5(1.905,2.683) 6(0.635,2.683) 7(-0.635,2.683) 8(-1.905,2.683)
  rect 3.2x2.3 smd: 9(0,0)
FC-135R_L3.2-W1.5
  rect 1x1.8 smd: 1(-1.25,0) 2(1.25,0)
FUSE-SMD_L10.1-W3.1
  rect 3.25x3.43 smd: 1(-4.7,0) 2(4.7,0)
HDR-TH_4P-P2.54-V-F
  rect 1.7x1.7 hole 1.1: 1(-3.81,0)
  round 1.7 hole 1.1: 2(-1.27,0) 3(1.27,0) 4(3.81,0)
HDR-TH_4P-P2.54-V-M
  rect 1.7x1.7 hole 1.1: 1(-3.81,0)
  round 1.7 hole 1.1: 2(-1.27,0) 3(1.27,0) 4(3.81,0)
HDR-TH_6P-P2.54-H-M-R2-C3-S2.54
  rect 1.778x1.8 hole 1.1: 1(-2.54,-1.27)
  round 1.8 hole 1.1: 2(-2.54,1.27) 3(0,-1.27) 4(0,1.27) 5(2.54,-1.27) 6(2.54,1.27)
HDR-TH_6P-P2.54-V-F-R2-C3-S2.54
  rect 1.7x1.6 hole 1: 1(-2.54,-1.27)
  round 1.6 hole 1: 2(-2.54,1.27) 3(0,-1.27) 4(0,1.27) 5(2.54,-1.27) 6(2.54,1.27)
HDR-TH_16P-P2.54-H-M-R2-C8-S2.54
  rect 1.778x1.8 hole 1.1: 1(-8.89,-1.27)
  round 1.8 hole 1.1: 2(-8.89,1.27) 3(-6.35,-1.27) 4(-6.35,1.27) 5(-3.81,-1.27) 6(-3.81,1.27) 7(-1.27,-1.27) 8(-1.27,1.27) 9(1.27,-1.27) 10(1.27,1.27) 11(3.81,-1.27) 12(3.81,1.27) 13(6.35,-1.27) 14(6.35,1.27) 15(8.89,-1.27) 16(8.89,1.27)
HDR-TH_16P-P2.54-V-F-R2-C8-S2.54
  rect 1.8x1.8 hole 1: 1(-8.89,-1.27)
  round 1.8 hole 1: 2(-8.89,1.27) 3(-6.35,-1.27) 4(-6.35,1.27) 5(-3.81,-1.27) 6(-3.81,1.27) 7(-1.27,-1.27) 8(-1.27,1.27) 9(1.27,-1.27) 10(1.27,1.27) 11(3.81,-1.27) 12(3.81,1.27) 13(6.35,-1.27) 14(6.35,1.27) 15(8.89,-1.27) 16(8.89,1.27)
IND-SMD_L4.4-W4.2
  rect 1.4x2.12 smd: 1(2.028,0) 2(-2.028,0)
IND-TH_4P-L22.5-W14.5-P13.00-D1.2-LS10.80
  round 2 hole 1.5: 1(-6.5,5.4) 2(6.5,5.4) 3(6.5,-5.4) 4(-6.5,-5.4)
L0603
  rect 0.8x0.864 smd: 1(-0.7,0) 2(0.7,0)
LED0603-RD
  rect 0.8x0.8 smd: 1(-0.799,0) 2(0.799,0)
LQFP-48_L7.0-W7.0-P0.50-LS9.0-TL
  oval 1.8x0.28 smd: 1(-4.05,2.75) 2(-4.05,2.25) 3(-4.05,1.75) 4(-4.05,1.25) 5(-4.05,0.75) 6(-4.05,0.25) 7(-4.05,-0.25) 8(-4.05,-0.75) 9(-4.05,-1.25) 10(-4.05,-1.75) 11(-4.05,-2.25) 12(-4.05,-2.75) 25(4.05,-2.75) 26(4.05,-2.25) 27(4.05,-1.75) 28(4.05,-1.25) 29(4.05,-0.75) 30(4.05,-0.25) 31(4.05,0.25) 32(4.05,0.75) 33(4.05,1.25) 34(4.05,1.75) 35(4.05,2.25) 36(4.05,2.75)
  oval 0.28x1.8 smd: 13(-2.75,-4.05) 14(-2.25,-4.05) 15(-1.75,-4.05) 16(-1.25,-4.05) 17(-0.75,-4.05) 18(-0.25,-4.05) 19(0.25,-4.05) 20(0.75,-4.05) 21(1.25,-4.05) 22(1.75,-4.05) 23(2.25,-4.05) 24(2.75,-4.05) 37(2.75,4.05) 38(2.25,4.05) 39(1.75,4.05) 40(1.25,4.05) 41(0.75,4.05) 42(0.25,4.05) 43(-0.25,4.05) 44(-0.75,4.05) 45(-1.25,4.05) 46(-1.75,4.05) 47(-2.25,4.05) 48(-2.75,4.05)
OSC-SMD_4P-L3.2-W2.5-BL
  rect 1.4x1.2 smd: 1(-1.1,-0.875) 2(1.1,-0.875) 3(1.1,0.875) 4(-1.1,0.875)
Pad_e72
  round 5 hole 3.2: 49(0,0)
Pad_e85
  round 5 hole 3.2: 49(0,0)
Pad_e86
  round 5 hole 3.2: 50(0,0)
Pad_e87
  round 5 hole 3.2: 51(0,0)
Pad_e88
  round 5 hole 3.2: 52(0,0)
Pad_e96
  round 3 hole 2.5: 54(0,0)
PQ50电感
  round 6 hole 8.5x3: 1(33,30.325) 2(17,6.825)
R0603
  rect 0.806x0.864 smd: 1(-0.753,0) 2(0.753,0)
R0805
  rect 1.133x1.377 smd: 1(-1,0) 2(1,0)
R1206
  rect 1.208x1.701 smd: 1(-1.479,0) 2(1.479,0)
RELAY-TH_HF3FF-XX-1ZXX-XXX
  round 2 hole 1.3: 1(-5.1,-6) 2(-5.1,6) 3(7.1,6) 5(7.1,-6)
  round 2.2 hole 1.5: 4(-7.1,0)
RES-SMD_L6.4-W3.2-R2512
  rect 2x3.3 smd: 1(-3.067,0) 2(3.067,0)
RES-TH_L2.5-W2.5-P1.70-D0.3
  round 1 hole 0.55: 1(-0.85,0) 2(0.85,0)
RES-TH_L17.5-W6.0-P7.50-D1.0-S2.00
  round 1.8 hole 1.1: 1(-3.75,1) 2(3.75,-1)
SMA_L4.4-W2.6-LS5.0-RD
  rect 1.8x1.7 smd: 1(-2.192,0) 2(2.192,0)
SMC_L6.9-W5.9-LS7.9-RD
  rect 2.7x3.3 smd: 1(-3.687,0) 2(3.687,0)
SOD-123_L2.8-W1.8-LS3.7-FD
  rect 1.2x1.4 smd: 1(-1.7,0) 2(1.7,0)
SOD-123FL_L2.8-W1.8-LS3.7-RD-1
  rect 0.93x1.2 smd: 1(-1.65,0) 2(1.65,0)
SOIC-8_L4.9-W4.0-P1.27-LS6.0-BL
  rect 0.63x1.865 smd: 1(-1.905,-2.683) 2(-0.635,-2.683) 3(0.635,-2.683) 4(1.905,-2.683) 5(1.905,2.683) 6(0.635,2.683) 7(-0.635,2.683) 8(-1.905,2.683)
SOIC-16_L9.9-W3.9-P1.27-LS6.0-BL-1
  oval 0.6x1.8 smd: 1(-4.445,-2.972) 2(-3.175,-2.972) 3(-1.905,-2.972) 4(-0.635,-2.972) 5(0.635,-2.972) 6(1.905,-2.972) 7(3.175,-2.972) 8(4.445,-2.972) 9(4.445,2.972) 10(3.175,2.972) 11(1.905,2.972) 12(0.635,2.972) 13(-0.635,2.972) 14(-1.905,2.972) 15(-3.175,2.972) 16(-4.445,2.972)
SOT-23-3_L2.9-W1.3-P1.90-LS2.4-BR
  rect 1.25x0.7 smd: 1(1,-0.95) 2(1,0.95) 3(-1,0)
SOT-23-5_L2.9-W1.6-P0.95-LS2.8-TL
  rect 1.1x0.6 smd: 1(-1.3,0.95) 2(-1.3,0) 3(-1.3,-0.95) 4(1.3,-0.95) 5(1.3,0.95)
SOT-23-5_L3.0-W1.7-P0.95-LS2.8-BR
  rect 1.1x0.6 smd: 1(1.3,-0.95) 2(1.3,0) 3(1.3,0.95) 4(-1.3,0.95) 5(-1.3,-0.95)
SOT-23-6_L2.9-W1.6-P0.95-LS2.8-BL
  rect 0.532x1.072 smd: 1(-0.95,-1.149) 2(0,-1.149) 3(0.95,-1.149) 4(0.95,1.149) 5(0,1.149) 6(-0.95,1.149)
SW-SMD_4P-L3.7-W3.0-P1.50-LS4.7
  rect 1.5x0.9 smd: 1(-1.9,0.75) 1(1.9,0.75) 2(-1.9,-0.75) 2(1.9,-0.75)
TO-247-3_L15.9-W5.1-P5.44-L
  rect 2.8x2 hole 2x1.2: 1(-5.56,0)
  oval 2.8x2 hole 2x1.2: 2(0,0) 3(5.56,0)
TO-247-4_L15.8-W5.0-P2.54-L
  oval 2x1.2 hole 1.5x0.8: 1(-5.08,0) 2(0,0) 3(2.54,0) 4(5.08,0)
TR1495_10_20_20
  rect 1.8x1.8 hole 1: 1(0,0)
  round 1.8 hole 1: 2(7.5,0) 3(11,0) 4(11,5.5) 5(7.5,5.5) 6(0,5.5)

## Nets
As in the schematic, except:
GND: C19.1 C20.2 C21.2 C22.1 C23.2 C24.1 C25.1 C26.1 C27.1 C28.1 C29.1 C30.1 C31.1 C32.1 C33.2 C45.1 C46.1 C62.1 C63.1 C69.1 C70.2 C71.1 C72.2 C73.1 C74.1 C75.2 C76.1 C77.2 C78.2 C81.2 C82.2 C83.1 C84.1 C87.1 C88.1 C92.2 C93.2 C96.2 C97.1 C98.1 C99.2 C103.1 C104.1 C107.2 C108.2 C109.1 C110.2 C111.1 C112.2 C113.2 C114.1 C115.2 C116.1 C117.1 C118.1 C119.1 C120.1 C122.1 C123.2 C124.2 C125.1 D2.1 D23.1 H1.9 H2.10 H3.3 H4.4 H5.4 L1.1 LED2.1 NOREF#5.51 NOREF#6.52 OLED1.1 Q3.2 Q6.2 R1.2 R4.2 R5.2 R18.1 R26.1 R27.1 R28.1 R50.1 R75.1 R76.1 R77.1 R78.1 R79.2 R96.1 R97.2 R101.1 R109.2 SW1.1 U5.1 U6.2 U8.2 U8.9 U11.2 U11.9 U13.2 U14.4 U15.4 U16.4 U17.4 U18.4 U19.8 U19.23 U19.47 U20.2 U21.2 X3.4
PGND: C9.2 C10.2 C11.2 C12.1 C13.1 C14.1 C15.2 C16.2 C17.1 C18.1 C64.1 C65.1 C66.1 C67.1 C105.1 C106.1 D15.1 D16.1 Q4.2 Q5.3 R45.1 R74.1 R89.1 R102.1 R111.1 U2.2 U4.2 U18.8
HGND: C5.1 C47.1 C48.1 C49.1 C50.1 C90.1 C91.1 D8.1 D9.1 L4.2 Q2.3 Q5.2 R8.1 R36.1 R62.1 U14.1 U16.8
HV: C8.2 C15.1 C16.1 C17.2 C18.2 K1.5 Q1.1 Q2.2 R16.1 U3.1
LFDN: D22.2 Q5.1 R71.2 R72.2 R74.2
LFUP: D19.2 Q2.1 R58.2 R59.2 R62.2

Pads without a net: H1 3 4 8 15; H2 3 4 7 16; H3 6; H4 5; NOREF 49; NOREF#2 49; NOREF#3 54; NOREF#4 50; U8 1 6 7; U11 1 6 7; U19 2 10 11 12 16 17 21 22 25 26 27 28 29 30 31 32 33 35 36 38 39 40 41 45 46; X2 2 4

## Via types
v1: diameter 0.762, hole 0.508, Top Layer to Bottom Layer, 153 vias
v2: diameter 0.762, hole 0.381, Top Layer to Bottom Layer, 315 vias

## Routing (per net, layer and track width the routed paths; a pad name or vN(x,y) marks a point on that pad's centre or on a via; arc(x,y) is an arc through that point)
+5V: length 226.5
  Top Layer w0.254: R48.1 150.81,104.24 C72.1 ; 147.7,92.23 150.53,92.23 R49.2
  Top Layer w0.508: v2(142.37,57.56) 142.42,57.51 147.96,57.51 ; 147.96,57.51 147.96,37.37 v2(152.53,32.8) ; 147.96,57.51 147.96,73.18 145.54,75.6 ; v2(155.83,32.67) 176.66,32.67 176.85,32.48 C119.2 176.85,30.29 ; 176.85,30.29 176.85,29.49 L6.1 ; 176.85,30.29 176.94,30.38 R103.2 ; R99.2 143.72,74.96 144.91,74.96 145.54,75.6 ; 145.54,75.6 145.54,90.08 147.7,92.23 v2(147.7,101.89) 147.7,103.03 148.46,103.79 C72.1 150.24,103.67 150.24,101.89 151.39,100.74 L5.2
  Bottom Layer w0.508: v2(152.53,32.8) 152.65,32.67 v2(155.83,32.67) ; H2.11 152.78,116.24 147.7,111.16 v2(147.7,101.89) ; v2(142.37,57.56) 142.31,57.5 C81.1 C82.1 138.22,57.5 U16.1 137.41,59.47 137.03,59.85 132.97,59.85 130.98,57.86 C96.1 C99.1 117.52,57.86 U18.1 116.97,58.42 116.97,59.72 116.59,60.1 112.27,60.1 111.57,59.41 C92.1 C93.1 91.99,59.41 U17.1 91.31,61.5 91.06,61.75 87,61.75 84.71,59.47 C77.1 71.36,59.47 U15.1
+5V1: length 65.3
  Top Layer w0.254: H1.12 143.76,157.39 143.76,159.67 144.02,159.93 144.02,160.56 ; 144.02,160.56 v2(144.02,161.45) ; 144.02,160.56 137.03,160.56 136.27,159.8 v2(136.27,155.32) 136.27,144.3 v2(136.4,144.18)
  Bottom Layer w0.254: U5.12 140.12,144.43 138.94,144.43 138.68,144.18 v2(136.4,144.18) 136.36,144.22 C22.2 ; R87.2 161.15,159.15 160.91,158.91 160.91,158.09 C116.2 ; 136.27,153.89 C32.2 ; 136.27,153.89 U6.5 ; 136.27,153.89 136.27,155.23 ; C116.2 161.06,157.8 U20.1 ; C116.2 160.84,160.62 160.53,160.94 144.53,160.94 v2(144.02,161.45)
+12V: length 240
  Top Layer w0.508: C76.2 159.53,91.54 R47.2 159.51,90.07 159.51,89.06 159.13,88.68 157.61,88.68 157.44,88.51 C71.2 C70.1 157.18,86.14 C75.1 ; C76.2 159.72,91.73 160.53,91.73 160.91,92.11 160.91,95.28 160.4,95.79 160.4,110.9 161.16,111.67 v2(166.88,111.67) 179.2,111.67 v2(179.32,111.79) ; C76.2 C74.2 156.31,91.68 U13.5 ; v2(155.07,14) 154.94,14.13 154.94,31.78 148.84,37.88 148.84,80.3 151.64,83.09 154.31,83.09 154.69,83.47 C75.1 ; v2(154.69,87.54) 154.69,86.14 C75.1 ; K1.2 137.26,7.07 139.24,9.05 150.93,9.05 D1.2 152.97,7.57 R19.2 153.93,9.95 154.18,10.19 v2(155.13,10.19) 156.46,10.19 157.1,9.56 157.1,7.02 158.12,6 180.47,6 186.18,11.72 X3.1
  Bottom Layer w0.508: U8.3 166.69,108.79 166.69,108.79 166.69,111.47 v2(166.88,111.67) ; v2(155.07,14) 155.07,10.26 v2(155.13,10.19) ; v2(179.32,111.79) 179.32,110.86 C45.2 179.55,110.63 U11.3 ; v2(154.69,87.54) 141.73,87.54 140.13,89.14 U14.3
GND: length 251.2
  Top Layer w0.508: v2(87.06,58.73) 91.42,58.73 v2(92.2,57.94) ; C19.1 155.81,3.78 155.69,3.9 ; v2(125.98,56.42) v2(125.98,51.98) ; v2(75.95,61.37) 75.95,58.45 v2(76.33,58.07) ; U14.4 142.62,94.94 v2(142.62,93.1) 142.62,73.44 143.64,72.42 v2(143.64,58.83) ; v2(118.1,56.46) 117.62,56.94 v2(110.99,56.94) ; U13.2 152.67,91.61 R50.1
  Top Layer w1: 33.13,74.47 33.13,61.01 35.56,58.58 v2(67.18,58.58)
  Bottom Layer w0.254: 178.18,145.32 177.8,145.7 175.64,145.7 175.38,145.44 U19.8 ; U19.23 179.67,138.12 179.96,137.83 v2(179.96,136.94) ; 46.99,76.23 48.26,76.23 49.02,76.99 49.02,81.19 R1.2 ; 169.04,142.4 169.25,142.62 U19.47 ; C118.1 164.27,155.48 162.43,155.48 162.01,155.9 U20.2 162.01,157.79 C116.1 ; 162.43,124.62 162.43,128.3 163.32,129.19 OLED1.1
  Bottom Layer w0.508: 94.68,57.94 C92.2 C93.2 93.03,57.94 ; 94.68,57.94 109.98,57.94 v2(110.99,56.94) 111.63,56.29 112.57,56.29 ; 94.68,57.94 93.03,57.94 ; 112.57,56.29 112.71,56.15 112.71,56.74 113.16,57.18 U18.4 ; 112.57,56.29 112.57,54.55 R76.1 ; C104.1 117.48,56.46 v2(118.1,56.46) C99.2 C96.2 120.57,56.42 v2(125.98,56.42) 133.16,56.42 C87.1 ; 87.06,57.82 87.06,56.35 R77.1 ; 87.06,57.82 v2(87.06,58.73) 87.06,59.64 U17.4 ; 87.06,57.82 86.8,58.07 v2(76.33,58.07) 76.3,58.05 C78.2 72.88,57.69 C83.1 ; C87.1 133.41,54.44 R75.1 ; C87.1 133.6,56.36 U16.4 ; v2(75.95,61.37) 67.44,61.37 67.18,61.12 U15.4 v2(67.18,58.58) 66.8,58.2 66.8,56.16 R78.1 ; C98.1 92.9,57.82 93.03,57.94 ; 93.03,57.94 v2(92.2,57.94) ; v2(143.64,58.83) 143.64,56.42 143.32,56.1 139.32,56.1 139.19,56.23 C88.1 137.7,52.26 137.41,51.98 v2(125.98,51.98)
  vias: v1(164.21,109.76) v1(173.99,142.91) v1(176.78,140.75) v1(176.78,109.89) v1(182.75,24.92) v2(121.03,118.78) v2(130.18,154.21) v2(130.3,149.13) v2(130.3,138.72) v2(130.43,145.07) v2(131.44,118.27) v2(131.44,117) v2(131.44,115.98) v2(131.83,134.65) v2(134.11,146.34) v2(134.75,157.89) v2(134.73,149.51) v2(134.69,140.3) v2(135.89,161.96) v2(136.4,133) v2(137.6,155.22) v2(137.79,161.96) v2(137.79,158.4) v2(138.43,151.29) v2(139.06,154.21) v2(139.83,161.96) v2(139.83,111.16) v2(139.83,101.12) v2(140.08,86.52) v2(140.34,136.18) v2(140.97,151.8) v2(140.97,115.09) v2(141.22,154.46) v2(141.48,132.75) v2(142.24,111.16) v2(142.49,145.36) v2(142.49,143.92) v2(142.49,139.12) v2(142.88,137.45) v2(142.88,101) v2(143.38,91.47) v2(144.15,93.63) v2(144.65,95.03) v2(144.78,154.34) v2(145.8,115.09) v2(146.05,132.49) v2(146.05,93.25) v2(146.3,150.91) v2(146.43,136.05) v2(146.43,104.93) v2(146.56,109.25) v2(146.81,86.14) v2(146.94,84.74) v2(147.32,150.91) v2(148.59,90.71) v2(148.7,151.95) v2(148.72,137.57) v2(148.72,115.09) v2(149.22,94.52) v2(149.35,95.79) v2(149.61,153.45) v2(149.99,84.61) v2(150.24,132.75) v2(151.44,93.23) v2(151.51,159.93) v2(151.89,153.19) v2(151.87,146.48) v2(152.02,139.99) v2(152.02,84.58) v2(152.15,135.16) v2(152.65,111.16) v2(153.29,101.89) v2(153.54,142.78) v2(153.8,137.95) v2(153.92,159.93) v2(154.18,145.83) v2(154.18,127.92) v2(154.22,89.22) v2(155.07,152.81) v2(155.7,105.32) v2(155.74,102.27) v2(155.83,84.61) v2(156.08,88.3) v2(156.21,4.99) v2(156.72,114.21) v2(157.48,0.92) v2(157.61,111.03) v2(157.73,138.72) v2(157.75,94.26) v2(158.12,107.22) v2(158.24,22.89) v2(158.24,16.31) v2(158.27,103.79) v2(158.37,128.18) v2(158.5,29.62) v2(158.62,141) v2(158.62,98.97) v2(158.62,4.86) v2(159.04,94.26) v2(159.26,10.83) v2(159.38,12.22) v2(159.51,150.65) v2(159.64,159.67) v2(159.64,152.56) v2(159.64,146.59) v2(159.89,0.92) v2(160.91,131.99) v2(161.04,134.78) v2(161.16,128.56) v2(161.16,120.05) v2(161.42,141.51) v2(161.8,0.92) v2(162.02,155.13) v2(162.18,4.86) v2(162.43,160.69) v2(162.56,145.83) v2(162.56,138.84) v2(162.56,117.13) v2(162.81,150.65) v2(162.83,10.8) v2(163.32,158.15) v2(163.45,148.75) v2(163.45,113.82) v2(163.58,17.81) v2(163.7,19.08) v2(164.08,160.69) v2(164.72,119.92) v2(164.66,9.76) v2(164.97,147.73) v2(165.23,150.86) v2(165.35,25.36) v2(165.35,22.51) v2(165.48,150.15) v2(165.48,30.77) v2(165.46,0.92) v2(165.61,141.38) v2(165.74,156.62) v2(165.74,134.78) v2(165.99,145.96) v2(165.99,131.73) v2(166,2.7) v2(166.06,103.99) v2(167.49,0.92) v2(167.64,152.69) v2(168.28,20.99) v2(168.26,3.21) v2(168.53,117.13) v2(168.78,120.05) v2(169.42,161.32) v2(169.54,20.1) v2(169.67,113.82) v2(169.8,109.51) v2(170.56,103.41) v2(170.94,18.96) v2(171.07,104.43) v2(171.45,31.02) v2(171.58,153.07) v2(171.83,17.56) v2(171.81,3.97) v2(172.21,16.01) v2(172.21,13.24) v2(172.47,109.51) v2(172.85,153.07) v2(172.97,120.05) v2(173.61,104.3) v2(173.9,139.61) v2(173.86,3.97) v2(173.99,152.43) v2(174.37,134.53) v2(174.88,161.58) v2(174.88,139.61) v2(175.13,152.43) v2(175.26,113.95) v2(175.51,30.04) v2(175.51,27.52) v2(175.51,24.92) v2(175.64,153.07) v2(175.64,117.13) v2(175.76,104.26) v2(176.28,134.4) v2(176.4,153.07) v2(176.42,3.97) v2(177.29,152.69) v2(177.42,151.67) v2(177.42,150.65) v2(177.42,149.64) v2(177.93,3.97) v2(178.18,148.88) v2(178.92,104.22) v2(179.45,147.61) v2(179.58,16.16) v2(179.71,19.84) v2(179.83,157.39) v2(179.83,155.1) v2(180.47,31.91) v2(180.59,130.59) v2(180.72,127.92) v2(180.72,121.19) v2(180.85,146.08) v2(181.74,135.67) v2(181.86,1.3) v2(181.99,19.84) v2(181.99,15.91) v2(182.63,159.54) v2(182.75,161.45) v2(183.01,108.36) v2(183.13,152.43) v2(183.26,29.12) v2(183.39,154.59) v2(183.51,126.91) v2(183.51,118.02) v2(183.77,130.46) v2(183.77,106.2) v2(183.77,103.79) v2(184.53,31.4) v2(186.69,130.46) v2(187.2,18.07) v2(187.32,103.28) v2(187.32,101.51) v2(187.32,98.33) v2(187.45,128.05) v2(187.58,114.97) v2(188.09,7.53) v2(188.72,145.57) v2(188.72,140.88) v2(188.85,135.41) v2(188.85,111.03) v2(189.1,160.81) v2(189.1,149.51) v2(189.23,41.05) v2(189.23,39.4)
PGND: length 249.8
  Top Layer w0.381: v2(126.37,43.34) 121.79,47.91 121.79,63.66 v2(121.92,63.79)
  Top Layer w1.524: 104.27,89.95 v2(104.27,89.3) 104.27,76.74 105.29,75.72 107.41,75.72 ; 102.74,90.79 v2(103.68,90.79) v2(104.27,90.2)
  Bottom Layer w0.254: 16.64,23.91 17.14,23.4 17.14,18.7 17.91,17.94 18.54,17.94 ; U4.2 4.62,20.17 4.06,20.73 4.06,39.91 5.59,41.43 18.51,41.43 R89.1
  Bottom Layer w0.381: v2(121.92,63.79) 116.97,63.79 U18.8 ; v2(126.37,43.34) 126.77,42.93 180.39,42.93 185.17,47.7 185.17,70.85 183.47,72.55 175.58,72.55 175.19,72.93 C67.1 ; 174.9,80.06 174.9,82.01 D16.1 174.56,82.34 D15.1
  Bottom Layer w0.508: 107.41,75.72 107.31,75.62 107.31,68.61 ; 174.9,78.26 R45.1 ; 174.9,78.26 174.9,76.53 C67.1 ; 174.9,78.26 C64.1 174.9,80.06 176.02,81.19 179.2,81.19 C66.1 180.78,79.6 C65.1 ; R74.1 107.94,67.99 107.31,68.61 ; 107.31,68.61 107.06,68.36 107.06,62.96 107.57,62.45 C106.1 111.69,62.14 116.33,62.14 116.97,62.77 U18.8
  Bottom Layer w1.524: v2(104.27,89.3) v2(104.27,90.2) v2(103.68,90.79) v2(102.97,90.79) 94.67,90.79 U2.2
  vias: v1(89.92,74.84) v1(90.93,74.84) v1(91.84,76.27) v1(91.84,75.25) v1(102.78,75.72) v1(102.78,74.71) v1(103.67,75.72) v1(103.67,74.71) v1(104.58,75.69) v1(104.58,74.67) v1(105.47,75.69) v1(105.47,74.67) v1(114.24,12.86) v1(114.24,11.97) v1(114.24,10.57) v1(114.24,9.56) v1(115.57,12.86) v1(115.57,11.97) v1(115.57,10.57) v1(115.57,9.56) v1(116.78,12.86) v1(116.78,11.97) v1(116.78,10.57) v1(116.78,9.56) v1(117.73,12.86) v1(117.73,11.97) v1(117.73,10.57) v1(117.73,9.56) v2(102.36,90.71)
VDD: length 100.3
  Bottom Layer w0.254: U19.48 170.56,143.13 170.56,144.05 170.93,144.42 U19.1 ; U19.48 161.16,143.12 160.91,143.37 160.91,151.64 C117.2 161.35,153.67 U20.5 ; U19.48 170.62,143.16 171.83,143.16 172.85,142.15 175.51,142.15 175.88,142.51 ; 171.83,130.97 OLED1.2 ; 171.83,130.97 155.83,130.97 ; 171.83,130.97 174.5,133.64 179.32,133.64 ; 178.82,135.48 179,135.67 ; 178.82,135.48 178.82,137.48 U19.24 177.76,137.62 175.88,139.5 175.88,142.51 ; 178.82,135.48 178.82,134.14 179.32,133.64 ; R80.2 188.2,151.65 187.58,151.04 187.58,134.14 187.07,133.64 179.32,133.64 ; U19.9 175.88,142.51
AC_CSP: length 40.9
  Top Layer w0.254: v2(183.9,144.56) 183.68,144.34 v2(148.62,144.34)
  Bottom Layer w0.254: R81.1 v2(183.9,144.56) ; C24.2 148.62,143.66 v2(148.62,144.34) 148.62,144.94 ; 148.62,144.94 R23.2 ; 148.62,144.94 147.83,144.94 147.09,145.68 U5.4
ACL: length 91.4
  Bottom Layer w0.254: R3.1 49.4,81.19 49.4,76.99 50.04,76.36 51.56,76.36
  Bottom Layer w0.508: U14.2 117.52,96.63 114.6,99.56 R7.1
  Bottom Layer w0.762: U2.1 86.61,94.52 88.52,96.43 105.16,96.43 110.36,91.22 116.59,91.22 117.52,92.15 U14.2 ; L3.3 73.47,113.25 72.52,114.21 58.24,114.21 C2.1
  Bottom Layer w1.524: U2.1 67.82,91.47
CSN: length 12.6
  Bottom Layer w0.254: H1.5 153.92,157.39 153.92,149.26 152.63,147.97 R22.2
CSN1: length 139.1
  Bottom Layer w0.254: H2.6 144.91,120.77 144.91,122.33 143,124.24 50.04,124.24 49.05,123.25 49.05,84.25 R1.1
CSP: length 8.3
  Bottom Layer w0.254: H1.6 153.42,155.35 153.42,150.15 152.63,149.36 R21.2
CSP1: length 140.3
  Bottom Layer w0.254: H2.5 145.07,117.98 143.89,119.16 143.89,122.33 142.34,123.88 50.32,123.88 49.4,122.97 49.4,84.22 R3.2
FAN_SEEPD: length 34.6
  Top Layer w0.254: v2(185.17,138.84) 185.17,146.97 v2(184.66,147.48)
  Bottom Layer w0.254: v2(184.66,147.48) 181.99,147.48 178.94,150.53 178.94,153.7 178.31,154.34 170.84,154.34 170.31,154.87 170.31,157.41 H3.5 ; R85.1 v2(185.17,138.84)
FAN_SEEPD1: length 146.5
  Top Layer w0.254: X3.3 186.69,28.86 187.45,29.62 187.45,34.83 185.67,36.61 185.67,112.05 175.77,121.95 130.06,121.95 128.65,120.54
GDH: length 20.3
  Bottom Layer w0.254: 142.75,158.4 143.76,157.39 143.76,152.31 142.49,151.04 142.49,147.48 141.99,146.97 140.16,146.97 U5.14 139.99,147.1 135.89,147.1 135.32,147.67 U6.3
GDH1: length 242.1
  Top Layer w0.381: v2(85.98,39.91) v2(85.98,54.64)
  Bottom Layer w0.254: v2(85.98,39.91) 86.13,39.76 183.88,39.76 189.13,45.01 189.13,106.94 173.74,122.33 156.08,122.33 155.32,121.57 H2.14
  Bottom Layer w0.508: R64.1 88.29,54.55 R51.1
GDL: length 21.9
  Bottom Layer w0.254: U5.13 138.94,145.68 138.03,146.59 135.64,146.59 133.99,148.24 133.99,150.27 134.37,150.65 135.31,150.65 ; 135.31,150.65 135.31,151.48 134.87,151.92 134.87,156.12 135.38,156.62 139.45,156.62 H1.16 ; 135.31,150.65 U6.4
GDL1: length 250.2
  Top Layer w0.381: v2(75.69,40.67) 75.69,52.74
  Bottom Layer w0.254: H2.15 176.44,117.98 188.77,105.65 188.77,45.16 183.73,40.11 87.3,40.11 86.74,40.67 v2(75.69,40.67)
  Bottom Layer w0.508: R78.2 68.39,54.52 R52.1 68.41,53.03 68.71,52.74 v2(75.63,52.74) 89.41,52.74 89.92,53.25 R63.1
H+13V: length 92.5
  Top Layer w0.508: v2(129.03,50.45) 129.03,65.31 v2(129.41,65.69)
  Bottom Layer w0.381: C48.2 161.23,71.73 160.78,71.28 148.84,71.28 146.56,68.99 146.56,52.86 144.15,50.45 v2(129.03,50.45)
  Bottom Layer w0.508: v2(129.41,65.69) 129.41,64.74 C90.2 130.93,64.62 C91.2 133.55,63.72 U16.5 ; R36.2 165.61,74.84 166.56,75.79 C50.2 166.86,76.91 C49.2 167.94,79.85 167.94,83.26 D6.2 ; C48.2 161.53,76.79 C47.2
H+18V: length 159.1
  Top Layer w0.508: v2(60.45,67.6) 60.58,67.72 v2(63.37,67.72)
  Bottom Layer w0.254: v2(63.37,67.72) 64.65,69 74.09,69 D17.2
  Bottom Layer w0.381: C37.2 157.41,52.04 154.18,48.8 81.28,48.8 80.65,49.44 63.5,49.44 60.45,52.48 v2(60.45,67.6)
  Bottom Layer w0.508: C34.2 155.91,66.86 D3.2 ; C34.2 157.1,64.81 157.48,64.42 158.75,64.42 159.26,63.91 C35.2 ; C34.2 156.15,64.72 C38.2 156.15,61.93 ; 157.35,54.75 157.35,59.85 156.15,61.06 156.15,61.93 ; 157.35,54.75 C36.2 ; 157.35,54.75 157.35,52.8 C37.2 ; U15.5 66.98,64.99 C89.2 64.32,64.99 63.37,65.95 C85.2 v2(63.37,67.72) ; 156.15,61.93 R31.2
H-6V: length 141.9
  Top Layer w0.381: 75.69,66.2 78.74,63.15 v2(78.74,47.78)
  Bottom Layer w0.381: v2(78.74,47.78) 161.16,47.78 163.07,49.69 163.07,52.54 C43.1 ; R31.1 157.6,63.35
  Bottom Layer w0.508: D17.1 75.12,70.58 75.69,70.01 v2(75.69,66.13) C80.1 71.01,65.18 U15.8 ; 163.72,61.39 163.72,54.93 C41.1 163.43,52.91 C43.1 ; 163.72,61.39 163.25,61.86 163.25,63.03 ; 163.72,61.39 D24.2 ; 163.25,63.03 157.92,63.03 C38.1 ; 163.25,63.03 C35.1 163.25,65.57 163.28,65.6 163.28,66.75 164.39,67.85
HDGND: length 159.2
  Top Layer w0.381: v2(95,45.62) 95,61.25 v2(92.33,63.91)
  Bottom Layer w0.381: D25.1 175.86,59.32 175.62,59.09 ; C60.2 177.44,53.29 C58.2 C59.2 C57.2 175.62,59.09 ; 175.62,59.09 R106.1 175.5,53.04 C54.1 175.26,52.68 175.26,47.91 172.97,45.62 v2(95,45.62)
  Bottom Layer w0.508: R68.1 83.05,68.99 82.42,68.99 81.85,69.57 ; 87.94,75.87 87.88,75.92 87.88,76.87 87.63,77.12 82.8,77.12 81.85,76.17 C102.1 81.85,69.57 ; C95.2 C94.2 85.85,63.98 C101.1 84.07,62.7 83.19,62.7 83.12,62.77 82.17,62.77 81.66,63.28 81.66,69.38 81.85,69.57
HFDN: length 17.2
  Bottom Layer w0.508: D21.2 85.4,73.39 85.4,75.87 ; D21.2 83.76,73.06 C102.2 83.25,70.7 R68.2 ; D21.2 85.73,71.23 R65.2 85.98,70.52 86.74,69.76 90.19,69.76 R66.2 92.33,69.99 D20.3
HFUP: length 15.9
  Bottom Layer w0.508: D17.3 72.3,69.74 66.29,69.74 65.91,70.12 R53.2
  Bottom Layer w0.762: 65.41,71.36 R53.2 ; 65.41,71.36 65.23,71.53 R60.2 63.87,69.94 C86.2 ; 65.41,71.36 D18.2 65.41,75.86 65.39,75.87
HGND: length 87.5
  Bottom Layer w0.381: U16.8 144.41,63.67 146.05,65.31 146.05,69.5 148.34,71.79 158.88,71.79 159.64,72.55 159.64,76.3 C48.1
  Bottom Layer w0.508: C50.1 165.16,78.47 C49.1 164.74,78.9 163.7,78.9 162.69,79.92 159.89,79.92 ; R8.1 114.47,104.55 113.03,104.55 111.89,103.41 111.89,95.54 U14.1 ; 126.91,67.48 126.91,75.21 127.41,75.72 ; 126.91,67.48 R62.1 ; 126.91,67.48 126.91,62.23 127.76,61.37 129.48,61.37 C90.1 130.93,61.43 C91.1 131.89,62.26 136.91,62.26 137.41,62.77 U16.8 ; C48.1 159.69,76.63 D9.1 D8.1
  vias: v1(111.63,78.14) v1(111.63,77.25) v1(112.52,78.14) v1(112.52,77.25) v1(113.28,78.11) v1(113.28,77.26) v1(114.17,78.11) v1(114.17,77.26) v1(125.6,78.01) v1(125.6,77.12) v1(125.6,76.11) v1(125.6,75.22) v1(125.86,74.2) v1(126.49,78.01) v1(126.49,77.12) v1(127,74.2) v1(127.38,78.14) v1(127.38,77.12) v1(127.89,74.2) v1(128.27,78.14) v1(128.27,77.12)
HUGND: length 179.3
  Bottom Layer w0.381: 61.34,68.36 61.21,68.49 60.07,68.49 59.69,68.1 59.69,52.1 63.12,48.67 80.01,48.67 80.39,48.29 156.97,48.29 158.88,50.2 158.88,52.68 C37.1
  Bottom Layer w0.508: C37.1 159.24,53.16 C36.1 ; 159.48,58.58 R105.1 ; 159.48,58.58 159.48,56.67 ; 159.48,58.58 D24.1 ; 159.48,58.58 C40.2 C42.2 ; 159.48,56.67 159.48,54.88 C36.1 ; 159.48,56.67 R107.1 ; 159.48,56.67 C42.2 ; C36.1 C41.2 ; 67.94,75.87 67.94,77.89 67.31,78.52 63.5,78.52 62.23,77.25 62.23,70.07 C86.1 62.42,69.44 61.34,68.36 61.34,64.29 62.1,63.53 63.3,63.53 C85.1 65.4,63.46 C89.1 65.66,63.72 C79.2 74.68,63.72 74.74,63.78 ; C41.2 161.56,54.77 C42.2 ; C41.2 161.43,52.75 161.29,52.61
HV:
  vias: v1(75.23,74.71) v1(75.23,73.69) v1(76.11,74.71) v1(76.11,73.69) v1(77.07,75.81) v1(77.09,74.71) v1(77.09,73.69) v1(77.96,75.81) v1(78.1,74.71) v1(78.1,73.69) v1(131.95,79.03) v1(131.95,77.88) v1(132.84,79.03) v1(132.84,77.88) v1(133.86,79.03) v1(133.86,77.88) v1(134.75,79.03) v1(134.75,77.88) v1(147.7,18.26) v1(147.7,17.43) v1(148.84,19.34) v1(148.91,16.29) v1(149.67,19.34) v1(149.73,16.29) v2(138.56,33.57) v2(138.56,32.67) v2(139.06,31.91) v2(139.19,34.32) v2(139.94,31.4) v2(140.21,34.58) v2(140.84,31.4) v2(140.97,34.07) v2(141.37,32.16) v2(141.48,33.18) v2(142.11,31.4) v2(142.24,32.54) v2(143,31.91)
HVBUS: length 9.9
  Bottom Layer w0.254: R92.1 13.41,37.19 12.19,35.97 12.19,33.18 12.06,33.05
  vias: v1(140.72,4.48) v1(140.72,3.59) v1(140.84,6.38) v1(140.84,5.49) v1(141.54,4.48) v1(141.6,3.59) v1(141.67,6.38) v1(141.73,5.49) v1(142.62,6.38) v1(142.62,5.49) v1(143.45,6.38) v1(143.51,5.49) v1(144.53,6.38) v1(144.53,5.49) v1(144.91,4.48) v1(144.91,3.59) v1(145.35,6.38) v1(145.41,5.49) v1(145.73,4.48) v1(145.8,3.59)
L+13V: length 154.5
  Top Layer w0.381: v2(125.6,42.58) 121.16,47.02 121.16,62.52 118.87,64.8 110.74,64.8 v2(110.49,64.55)
  Bottom Layer w0.381: v2(125.6,42.58) 125.73,42.45 180.59,42.45 185.65,47.5 185.65,71.05 183.64,73.06 177.04,73.06 176.59,73.5 C67.2
  Bottom Layer w0.508: U18.5 113.09,63.85 C106.2 109.67,65.56 109.42,65.56 C105.2 ; 176.85,76.49 181.86,76.49 182.18,76.81 C65.2 182.23,78.06 C66.2 182.93,80.86 D14.2 182.93,84.77 D13.2 ; 176.85,76.49 C67.2 ; 176.85,76.49 176.9,76.53 C64.2
L+18V: length 157.5
  Top Layer w0.381: v2(83.06,67.09) 83.19,66.96 v2(83.19,46.51)
  Top Layer w0.508: v2(94.34,67.85) 93.58,67.09 v2(83.06,67.09)
  Bottom Layer w0.381: C51.2 172.4,64.83 C55.2 172.4,62.7 R40.2 172.22,61.36 173.23,60.36 173.23,54.69 C53.2 173.8,54.12 C54.2 173.8,48.35 171.96,46.51 v2(83.19,46.51) ; C51.2 173.63,66.64 171.91,68.36 ; C51.2 173.63,65.93 174.75,64.8 177.48,64.8 C52.2
  Bottom Layer w0.508: D20.2 v2(94.34,67.85) ; U17.5 87.07,65.89 C100.2 83.44,66.71 v2(83.06,67.09)
L-6V: length 147.5
  Top Layer w0.381: v2(95.63,66.2) 96.01,65.82 v2(96.01,44.61)
  Bottom Layer w0.381: v2(96.01,44.61) 96.77,44.61 97.16,44.99 178.44,44.99 179.45,46.01 179.45,52.68 C60.1 179.44,53.04 C58.1 C59.1 C57.1 180.25,59.9 D25.2 179.39,62.74 179.39,63.13 ; C52.1 179.39,63.13 ; 179.39,63.13 177.44,63.13 176.4,64.17 C55.1 173.8,62.59 R40.1
  Bottom Layer w0.508: C52.1 179.82,64.72 C56.1 180.26,66.52 D11.1 ; D20.1 94.94,70.96 95.76,70.14 95.76,66.26 C95.1 C94.1 91.39,65.38 U17.8
  vias: v2(179.78,65.01)
LFDN: length 18.5
  Bottom Layer w0.508: R74.2 111.6,69.49 111.76,69.33 ; 111.76,69.33 D22.2 ; 111.76,69.33 112.01,69.08 112.01,68.61 112.78,67.85 116.09,67.85 R72.2 118.53,70.29 118.53,75.72
LFUP: length 19.6
  Bottom Layer w0.508: R62.2 131.99,68.98 R58.2 ; R58.2 132.21,68.34 132.46,68.09 R59.2 136.79,68.23 137.79,68.23 138.53,68.97 138.53,75.72 ; R58.2 131.57,69.84 D19.2
NTC: length 28.5
  Bottom Layer w0.254: H3.4 171.96,156.12 173.23,154.85 178.82,154.85 179.83,153.83 179.83,150.65 181.74,148.75 184.91,148.75 186.36,147.3 186.36,142.96 185.04,141.64 183.07,141.64 R83.1
NTC1: length 68.1
  Top Layer w0.254: H4.3 126.11,115.72 R101.2 125.99,114.07 126.75,113.32 v2(145.16,113.32)
  Bottom Layer w0.254: v2(145.16,113.32) 145.16,97.7 144.53,97.06 139.19,97.06 138.43,96.3 138.43,89.57 143.66,84.34 R99.1
P+5V: length 46.8
  Top Layer w0.254: v2(162.94,8.8) 166.37,8.8 167.13,9.55 v2(167.13,10.33)
  Top Layer w0.508: L6.2 176.98,27.97 C120.2 176.98,11.53 175.78,10.33 v2(167.13,10.33) ; v2(168.28,4.6) 167.26,4.6 167.2,4.67 D2.2
  Bottom Layer w0.254: U21.5 167.67,11.76 C123.1 v2(167.13,10.33) 167.13,9.6 C122.2 166.5,8.82 166.5,5.37 167.26,4.6 v2(168.28,4.6)
  Bottom Layer w0.762: D23.2 163.8,8.8 v2(162.94,8.8)
PA13: length 19.5
  Bottom Layer w0.254: 155.83,133.51 172.21,133.51 172.88,134.17 172.88,136.32
PA14: length 15.4
  Bottom Layer w0.254: 155.83,136.05 155.96,136.18 168.02,136.18 169.46,137.62 U19.37
PB6: length 28.6
  Top Layer w0.254: v2(168.55,138.34) 168.55,134.63 169.67,133.51 177.67,133.51 178.44,132.75 178.44,127.79 177.8,127.16 174.88,127.16 174.5,127.54 174.5,129.06 OLED1.3
  Bottom Layer w0.254: 168.53,138.46 168.53,139.22 169.42,140.12 U19.42
PB7: length 21.4
  Top Layer w0.254: v2(167.51,138.34) 167.51,134.14 169.16,132.49 175.9,132.49 176.78,131.6 176.78,129.32 OLED1.4
  Bottom Layer w0.254: U19.43 169.16,140.62 167.51,138.97 v2(167.51,138.34)
PE: length 74.8
  Top Layer w1: C7.2 78.87,121.01 74.8,121.01 74.75,121.06 15.24,121.06 13.72,119.54 U1.1
POWER_EN: length 41.7
  Bottom Layer w0.254: R86.1 185.29,137.45 186.94,139.1 186.94,139.99 187.2,140.24 187.2,148.37 185.37,150.2 182.57,150.2 181.36,151.42 181.36,158.02 179.07,160.31 173.23,160.31 172.85,159.93 172.85,157.41 H3.2
POWER_EN1: length 82.1
  Top Layer w0.254: v2(181.8,106.9) 181.8,110.58 179.83,112.55 125.48,112.55 123.57,114.46 H4.1
  Top Layer w0.508: v2(175.39,106.68) 181.58,106.68 v2(181.8,106.9)
  Bottom Layer w0.508: 181.86,106.84 v2(181.8,106.9) U11.4 ; U8.4 v2(175.39,106.68)
PWM: length 31.5
  Bottom Layer w0.254: H3.1 174.27,158.78 176.15,158.78 176.66,158.27 176.66,156.62 177.16,156.12 180.21,156.12 180.72,155.61 180.72,150.78 181.99,149.51 185.17,149.51 186.72,147.96 186.72,141.66 185.55,140.49 183.28,140.49 R84.1
PWM1: length 164.7
  Top Layer w0.254: R104.2 179.84,23.65 180.09,23.4 182.37,23.4 184.02,25.05 187.32,25.05 187.81,25.53 187.81,34.98 186.03,36.76 186.03,112.2 175.92,122.31 125.2,122.31 123.57,120.68 H4.2
RELY: length 25
  Bottom Layer w0.254: H1.7 150.11,158.02 148.84,156.75 148.84,155.48 143.76,150.4 143.76,142.4 141.97,140.6 U5.9 140.14,139.12 140.31,138.94
RELY1: length 180.4
  Top Layer w0.254: D2.3 162.58,2.43 163.19,1.81 169.15,1.81 170.05,2.72 170.05,4.22 170.81,4.99 180.59,4.99 188.16,12.55 188.16,35.12 186.38,36.9 186.38,112.35 176.02,122.71 148.46,122.71 v2(147.96,123.22)
  Top Layer w0.508: D2.3 161.03,3.72 R20.1
  Bottom Layer w0.254: H2.8 147.7,122.97 v2(147.96,123.22)
SFH: length 12.6
  Bottom Layer w0.254: U6.1 137.36,148.22 U5.15 141.46,148.22 141.99,148.75 141.99,151.67 142.49,152.18 H1.14
SFH1: length 199.7
  Top Layer w0.254: v2(123.82,53.63) 123.82,49.18 129.29,43.72 v2(129.29,40.8)
  Bottom Layer w0.254: H2.13 156.94,116.36 176.91,116.36 188.42,104.86 188.42,45.31 183.66,40.55 129.54,40.55 v2(129.29,40.8) ; R70.1 114.17,53.15 114.17,53.75 114.3,53.88 116.84,53.88 117.09,53.63 v2(123.82,53.63) 136.14,53.63 136.42,53.35 R55.1
  Bottom Layer w0.508: R70.1 114.02,53 R76.2
SFL: length 19.3
  Top Layer w0.254: H1.11 146.3,157.39 146.3,154.21 145.29,153.19 v2(139.95,153.19)
  Bottom Layer w0.254: 139.92,149.49 137.69,149.49 137.29,149.89 137.29,150.59 U6.6 ; 139.92,149.49 U5.16 ; 139.92,149.49 139.95,149.52 v2(139.95,153.19)
SFL1: length 203.3
  Top Layer w0.254: v2(124.84,52.74) 124.84,48.67 130.43,43.09 v2(130.43,38.89)
  Bottom Layer w0.254: R75.2 115.93,52.87 R69.1 ; 130.56,39.15 130.81,39.4 184.02,39.4 189.48,44.86 189.48,107.35 173.99,122.84 155.1,122.84 H2.12
  Bottom Layer w0.508: R75.2 134.86,52.87 R57.1
VACN: length 33.2
  Bottom Layer w0.254: H1.1 157.86,158.66 159.38,157.13 159.38,155.35 157.73,153.7 157.73,143.67 153.03,138.97 149.22,138.97 148.72,139.48 148.72,140.43 148.76,140.47 148.23,140.47 147.45,141.26 147.45,142.65 146.96,143.14 U5.6
VACN1: length 23.1
  Bottom Layer w0.508: R14.2 132.84,104.68 133.99,105.82 133.99,119.67 134.87,120.56 140.04,120.56 140.08,120.52
VACP: length 26.9
  Bottom Layer w0.254: U5.5 147.09,144.41 147.83,143.67 147.83,142.27 148.08,142.02 148.74,142.02 C26.2 148.72,141.96 148.72,141.26 148.84,141.13 153.54,141.13 156.46,144.05 156.46,154.85 H1.2
VACP1: length 23.8
  Bottom Layer w0.508: 140.08,117.98 140.04,118.02 136.14,118.02 135.51,117.38 135.51,103.41 132.84,100.74 R10.2
VDC_SEN: length 101
  Bottom Layer w0.254: 142.7,160.31 148.46,160.31 148.84,159.93 148.84,157.39 H1.10 ; 142.7,160.31 142.7,162.16 143,162.47 165.99,162.47 166.88,161.58 166.88,155.35 168.28,153.96 177.55,153.96 178.31,153.19 178.31,150.15 181.99,146.46 185.42,146.46 186,145.88 186,143.62 185.42,143.03 R82.1 ; 142.7,160.31 134.24,160.31 132.97,159.04 132.97,143.64 R25.2
VDC_SEN1: length 161
  Top Layer w0.254: H2.9 150.11,117.85 150.11,115.98 150.5,115.6 179.32,115.6 185.27,109.66 185.27,35.62 v2(186.44,34.45)
  Bottom Layer w0.254: R95.2 167.32,7.81 C125.2 171.99,7.81 173.35,9.18 183.64,9.18 188.47,14 188.47,32.8 187.07,34.2 186.56,34.2 186.31,34.45
VS:
  vias: v1(24.89,49.82) v1(24.89,48.8) v1(24.89,47.78) v1(25.02,53.37) v1(25.02,52.1) v1(24.97,50.83) v1(25.91,49.82) v1(25.91,48.8) v1(25.91,47.78) v1(26.03,53.37) v1(26.03,52.1) v1(25.99,50.83) v1(26.92,49.82) v1(26.92,48.8) v1(26.92,47.78) v1(27,50.83) v1(27.05,53.37) v1(27.05,52.1) v1(27.81,49.82) v1(27.81,48.8) v1(27.81,47.78) v1(27.94,53.37) v1(27.94,52.1) v1(27.89,50.83) v1(28.83,49.82) v1(28.83,48.8) v1(28.83,47.78) v1(28.91,50.83) v1(28.96,53.37) v1(28.96,52.1) v1(69.72,79.28) v1(69.72,78.01) v1(69.72,76.99) v1(70.61,79.28) v1(70.61,78.01) v1(70.61,76.99) v1(71.5,79.28) v1(71.5,78.01) v1(71.5,76.99) v1(72.37,76.98) v1(72.37,75.71) v1(72.52,79.28) v1(72.52,78.01) v1(94.62,74.71) v1(94.62,73.82) v1(95.44,74.71) v1(95.5,73.82) v1(96.27,74.71) v1(96.31,73.82) v1(97.04,75.71) v1(97.09,74.71) v1(97.11,73.82) v1(97.93,75.71) v1(97.92,74.71) v1(97.92,73.82)
